# Altium schematic sheet LOW_CURR_MOS.SchDoc
size A4; SheetNumber: 8; SheetTotal: 14
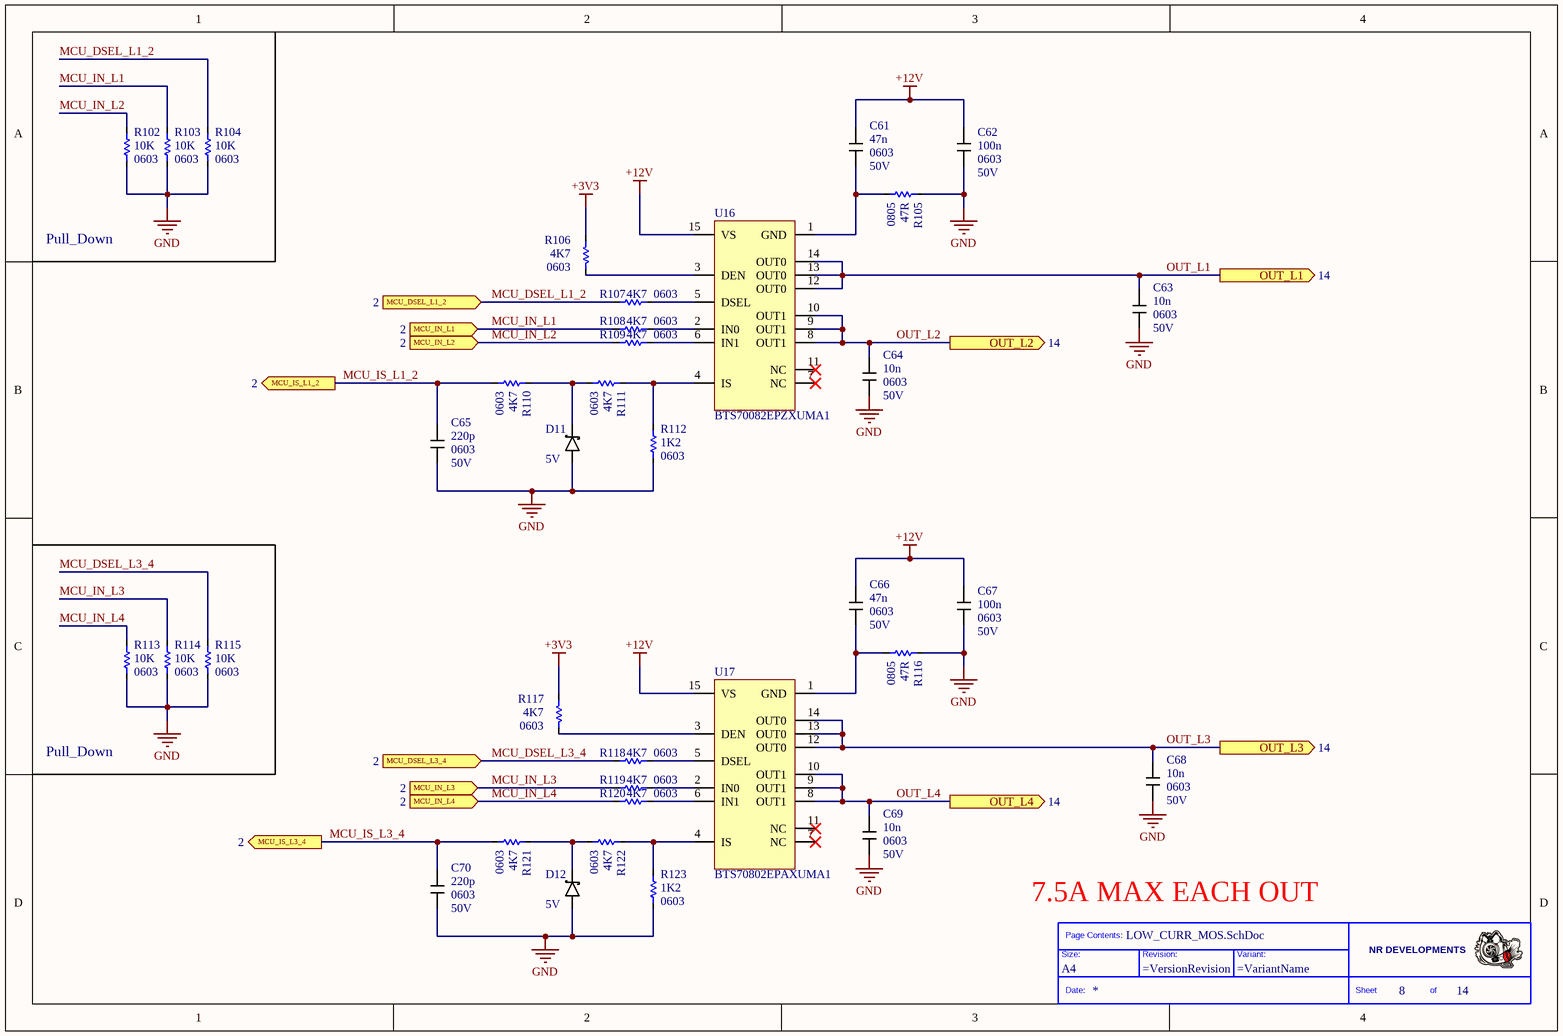
[diagram p0: LOW_CURR_MOS.SchDoc]

## Parts
*  Size: A4  (hidden comment: Title_Block)  (graphical)
C61  value 47n  Case: 0603  Voltage: 50V  [CAPC1608X09M]  (hidden comment: CAP)
C62  value 100n  Case: 0603  Voltage: 50V  [CAPC1608X09M]  (hidden comment: CAP)
C63  value 10n  Case: 0603  Voltage: 50V  [CAPC1608X09M]  (hidden comment: CAP)
C64  value 10n  Case: 0603  Voltage: 50V  [CAPC1608X09M]  (hidden comment: CAP)
C65  value 220p  Case: 0603  Voltage: 50V  [CAPC1608X09M]  (hidden comment: CAP)
C66  value 47n  Case: 0603  Voltage: 50V  [CAPC1608X09M]  (hidden comment: CAP)
C67  value 100n  Case: 0603  Voltage: 50V  [CAPC1608X09M]  (hidden comment: CAP)
C68  value 10n  Case: 0603  Voltage: 50V  [CAPC1608X09M]  (hidden comment: CAP)
C69  value 10n  Case: 0603  Voltage: 50V  [CAPC1608X09M]  (hidden comment: CAP)
C70  value 220p  Case: 0603  Voltage: 50V  [CAPC1608X09M]  (hidden comment: CAP)
D11  value 5V  [SOT65P210X100-3N - AC]  (hidden comment: Diode_Schottky)
D12  value 5V  [SOT65P210X100-3N - AC]  (hidden comment: Diode_Schottky)
R102  value 10K  Case: 0603  [RESC1608X06M]  (hidden comment: Res)
R103  value 10K  Case: 0603  [RESC1608X06M]  (hidden comment: Res)
R104  value 10K  Case: 0603  [RESC1608X06M]  (hidden comment: Res)
R105  value 47R  Case: 0805  [RESC2012X06N]  (hidden comment: Res)
R106  value 4K7  Case: 0603  [RESC1608X06M]  (hidden comment: Res)
R107  value 4K7  Case: 0603  [RESC1608X06M]  (hidden comment: Res)
R108  value 4K7  Case: 0603  [RESC1608X06M]  (hidden comment: Res)
R109  value 4K7  Case: 0603  [RESC1608X06M]  (hidden comment: Res)
R110  value 4K7  Case: 0603  [RESC1608X06M]  (hidden comment: Res)
R111  value 4K7  Case: 0603  [RESC1608X06M]  (hidden comment: Res)
R112  value 1K2  Case: 0603  [RESC1608X06M]  (hidden comment: Res)
R113  value 10K  Case: 0603  [RESC1608X06M]  (hidden comment: Res)
R114  value 10K  Case: 0603  [RESC1608X06M]  (hidden comment: Res)
R115  value 10K  Case: 0603  [RESC1608X06M]  (hidden comment: Res)
R116  value 47R  Case: 0805  [RESC2012X06N]  (hidden comment: Res)
R117  value 4K7  Case: 0603  [RESC1608X06M]  (hidden comment: Res)
R118  value 4K7  Case: 0603  [RESC1608X06M]  (hidden comment: Res)
R119  value 4K7  Case: 0603  [RESC1608X06M]  (hidden comment: Res)
R120  value 4K7  Case: 0603  [RESC1608X06M]  (hidden comment: Res)
R121  value 4K7  Case: 0603  [RESC1608X06M]  (hidden comment: Res)
R122  value 4K7  Case: 0603  [RESC1608X06M]  (hidden comment: Res)
R123  value 1K2  Case: 0603  [RESC1608X06M]  (hidden comment: Res)
U16  BTS70082EPZXUMA1  [SOP65P600X115-15]
U17  BTS70802EPAXUMA1  [SOP65P600X115-15]

## Ports
MCU_DSEL_L1_2 (in, see 2), MCU_DSEL_L3_4 (in, see 2), MCU_IN_L1 (in, see 2), MCU_IN_L2 (in, see 2), MCU_IN_L3 (in, see 2), MCU_IN_L4 (in, see 2), MCU_IS_L1_2 (out, see 2), MCU_IS_L3_4 (out, see 2), OUT_L1 (out, see 14), OUT_L2 (out, see 14), OUT_L3 (out, see 14), OUT_L4 (out, see 14)

## Nets
+3V3: R106.2 R117.2
+12V: C61.1 C62.1 C66.1 C67.1 U16.15(VS) U17.15(VS)
GND: C62.2 C63.2 C64.2 C65.2 C67.2 C68.2 C69.2 C70.2 D11.A D12.A R102.1 R103.1 R104.1 R105.2 R112.1 R113.1 R114.1 R115.1 R116.2 R123.1
MCU_DSEL_L1_2: R104.2 R107.1 ; port MCU_DSEL_L1_2
MCU_DSEL_L3_4: R115.2 R118.1 ; port MCU_DSEL_L3_4
MCU_IN_L1: R103.2 R108.1 ; port MCU_IN_L1
MCU_IN_L2: R102.2 R109.1 ; port MCU_IN_L2
MCU_IN_L3: R114.2 R119.1 ; port MCU_IN_L3
MCU_IN_L4: R113.2 R120.1 ; port MCU_IN_L4
MCU_IS_L1_2: C65.1 R110.1 ; port MCU_IS_L1_2
MCU_IS_L3_4: C70.1 R121.1 ; port MCU_IS_L3_4
OUT_L1: C63.1 U16.12(OUT0) U16.13(OUT0) U16.14(OUT0) ; port OUT_L1
OUT_L2: C64.1 U16.8(OUT1) U16.9(OUT1) U16.10(OUT1) ; port OUT_L2
OUT_L3: C68.1 U17.12(OUT0) U17.13(OUT0) U17.14(OUT0) ; port OUT_L3
OUT_L4: C69.1 U17.8(OUT1) U17.9(OUT1) U17.10(OUT1) ; port OUT_L4
NetC61_2: C61.2 R105.1 U16.1(GND)
NetC66_2: C66.2 R116.1 U17.1(GND)
NetD11_C: D11.C R110.2 R111.1
NetD12_C: D12.C R121.2 R122.1
NetR106_1: R106.1 U16.3(DEN)
NetR107_2: R107.2 U16.5(DSEL)
NetR108_2: R108.2 U16.2(IN0)
NetR109_2: R109.2 U16.6(IN1)
NetR111_2: R111.2 R112.2 U16.4(IS)
NetR117_1: R117.1 U17.3(DEN)
NetR118_2: R118.2 U17.5(DSEL)
NetR119_2: R119.2 U17.2(IN0)
NetR120_2: R120.2 U17.6(IN1)
NetR122_2: R122.2 R123.2 U17.4(IS)

Not connected (* = marked no-connect by the designer): U16 7(NC)* 11(NC)*; U17 7(NC)* 11(NC)*

## Notes on the sheet
- Pull_Down
- 7.5A MAX EACH OUT
- (in symbol Title_Block) Page Contents:; NR DEVELOPMENTS; Size:; Revision:; Variant:; Date:; Sheet; of

## Library data of the parts
C61 C66 = CAP: Manufacturer: KEMET; PartNumber: C0603C473M5RACTU
C62 C67 = CAP: Manufacturer: KEMET; PartNumber: C0603C104K5RACTU
C63 C64 C68 C69 = CAP: Manufacturer: KEMET; PartNumber: C0603C103M5RACTM
C65 C70 = CAP: Manufacturer: KEMET; PartNumber: C0603C221J5RACTU
D11 D12 = Diode_Schottky: Manufacturer: Nexperia; PartNumber: BZX84W-C4V7-QX; Case: SOT-323-3
R102-R104 R113-R115 = Resistor: Manufacturer: YAGEO; PartNumber: AC0603FR-0710KL
R105 R116 = Resistor: Manufacturer: Vishay; PartNumber: CRCW080547R0FKEA
R106-R111 R117-R122 = Resistor: Manufacturer: YAGEO; PartNumber: RC0603FR-074K7L
R112 R123 = Resistor: Manufacturer: Vishay; PartNumber: CRCW06031K20FKEA
U16 = BTS70082EPZXUMA1: Smart High-Side Power Switch 7.5A; Manufacturer: Infineon Technologies; PartNumber: BTS70082EPZXUMA1; Case: TSDSO-14; Value: BTS70082EPZXUMA1
U17 = BTS70802EPAXUMA1: Smart High-Side Power Switch 3A; Manufacturer: Infineon Technologies; PartNumber: BTS70802EPAXUMA1; Case: TSDSO-14; Value: BTS70802EPAXUMA1